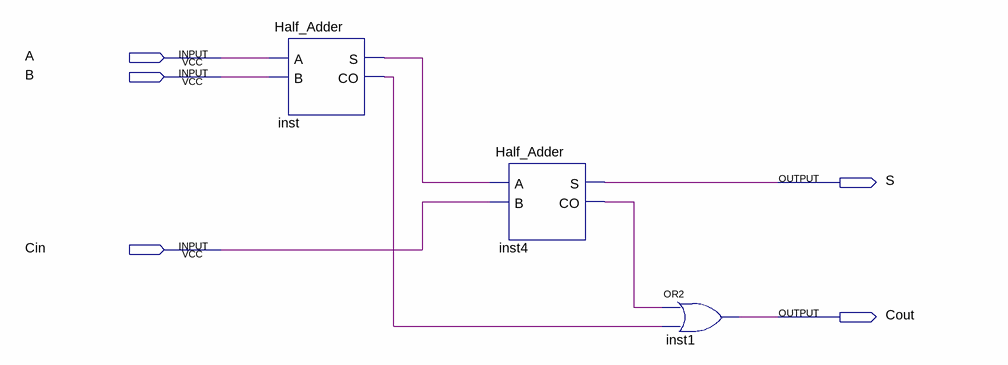
[diagram p0: schematic sheet]
// Quartus schematic fulladder.bdf as structural Verilog: 3 symbols, 5 pins
module fulladder (
  input  A,
  input  B,
  input  Cin,
  output S,
  output Cout
);

  wire inst4_co, inst_co, inst_s;

  Half_Adder inst (.A(A), .B(B), .S(inst_s), .CO(inst_co));
  Half_Adder inst4 (.A(inst_s), .B(Cin), .S(S), .CO(inst4_co));
  or inst1 (Cout, inst4_co, inst_co);
endmodule
